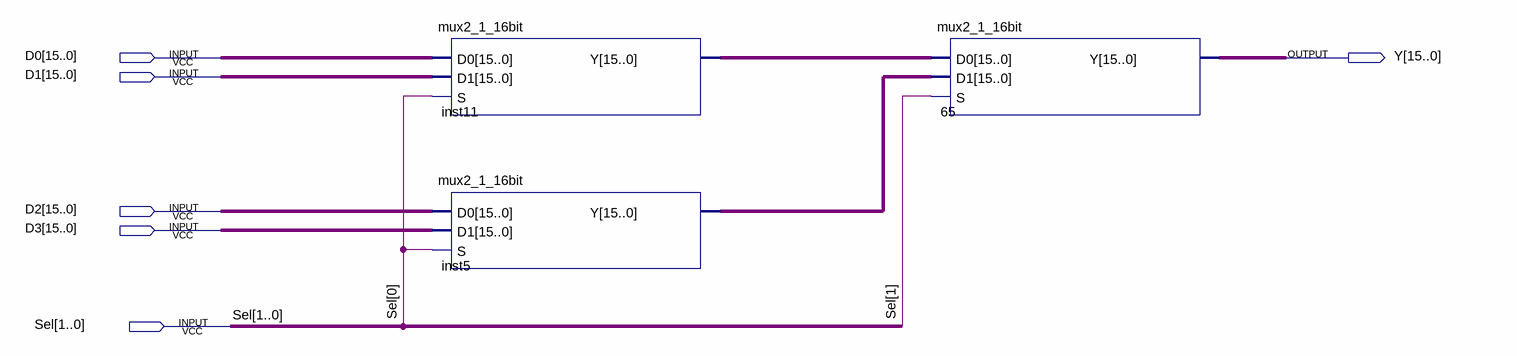
[diagram p0: schematic sheet]
// Quartus schematic mux4_1_16bit.bdf as structural Verilog: 3 symbols, 6 pins
module mux4_1_16bit (
  input  [15:0] D0,
  input  [15:0] D1,
  input  [15:0] D2,
  input  [15:0] D3,
  input  [1:0] Sel,
  output [15:0] Y
);

  wire [15:0] inst5_y, inst11_y;

  mux2_1_16bit inst11 (.D0(D0), .D1(D1), .S(Sel[0]), .Y(inst11_y));
  mux2_1_16bit inst5 (.D0(D2), .D1(D3), .S(Sel[0]), .Y(inst5_y));
  mux2_1_16bit u_65 (.D0(inst11_y), .D1(inst5_y), .S(Sel[1]), .Y(Y));
endmodule
